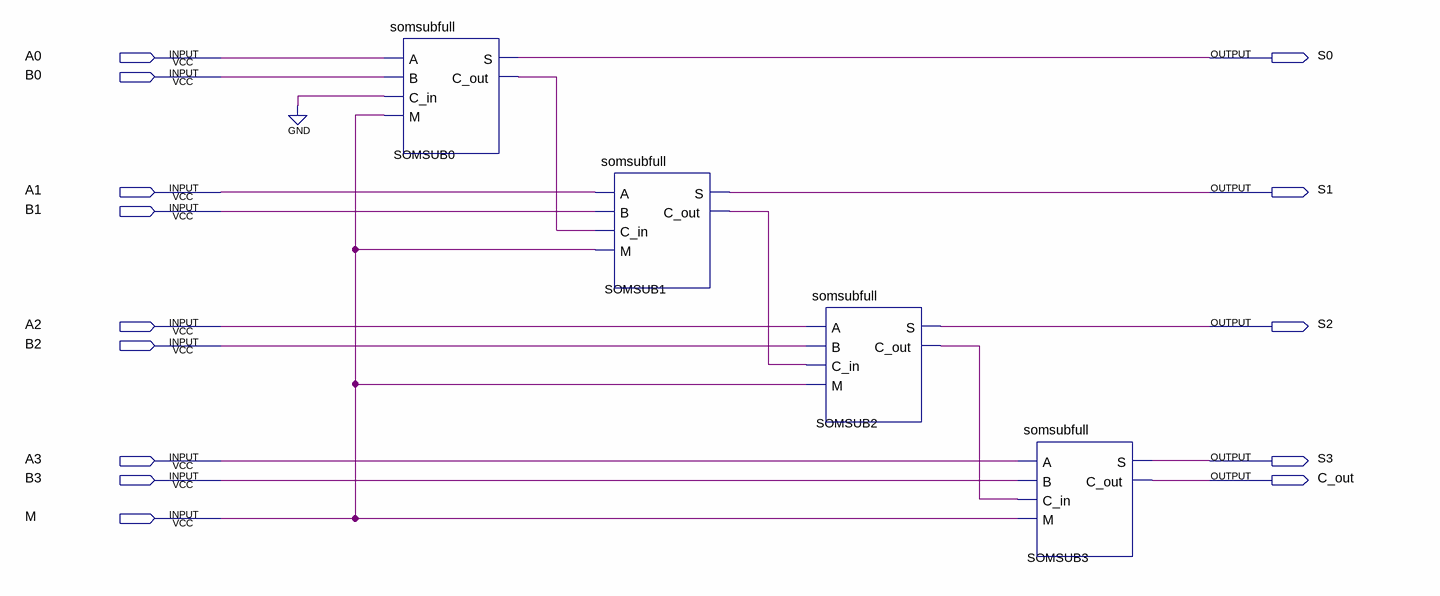
[diagram p0: schematic sheet]
// Quartus schematic somsub_4bits.bdf as structural Verilog: 4 symbols, 14 pins
module somsub_4bits (
  input  A0,
  input  B0,
  input  A1,
  input  B1,
  input  A2,
  input  B2,
  input  A3,
  input  B3,
  input  M,
  output S0,
  output S1,
  output S2,
  output S3,
  output C_out
);

  wire SOMSUB0_c_out, SOMSUB1_c_out, SOMSUB2_c_out;

  somsubfull SOMSUB0 (.A(A0), .B(B0), .C_in(1'b0), .M(M), .S(S0), .C_out(SOMSUB0_c_out));
  somsubfull SOMSUB1 (.A(A1), .B(B1), .C_in(SOMSUB0_c_out), .M(M), .S(S1), .C_out(SOMSUB1_c_out));
  somsubfull SOMSUB2 (.A(A2), .B(B2), .C_in(SOMSUB1_c_out), .M(M), .S(S2), .C_out(SOMSUB2_c_out));
  somsubfull SOMSUB3 (.A(A3), .B(B3), .C_in(SOMSUB2_c_out), .M(M), .S(S3), .C_out(C_out));
endmodule
